# EasyEDA Pro project ProPrj_ESP32智能门锁_2025-03-02.epro, schematic Schematic1

## Sheets
1 ESP32主控: Board Name: Board1; Create Date: 2025-01-09; Page Name: ESP32主控; Project Name: ESP32智能门锁; Schematic Name: Schematic1; Update Date: 2025-03-01; Company: 嘉立创EDA; Page Size: A4; Version: V1.3
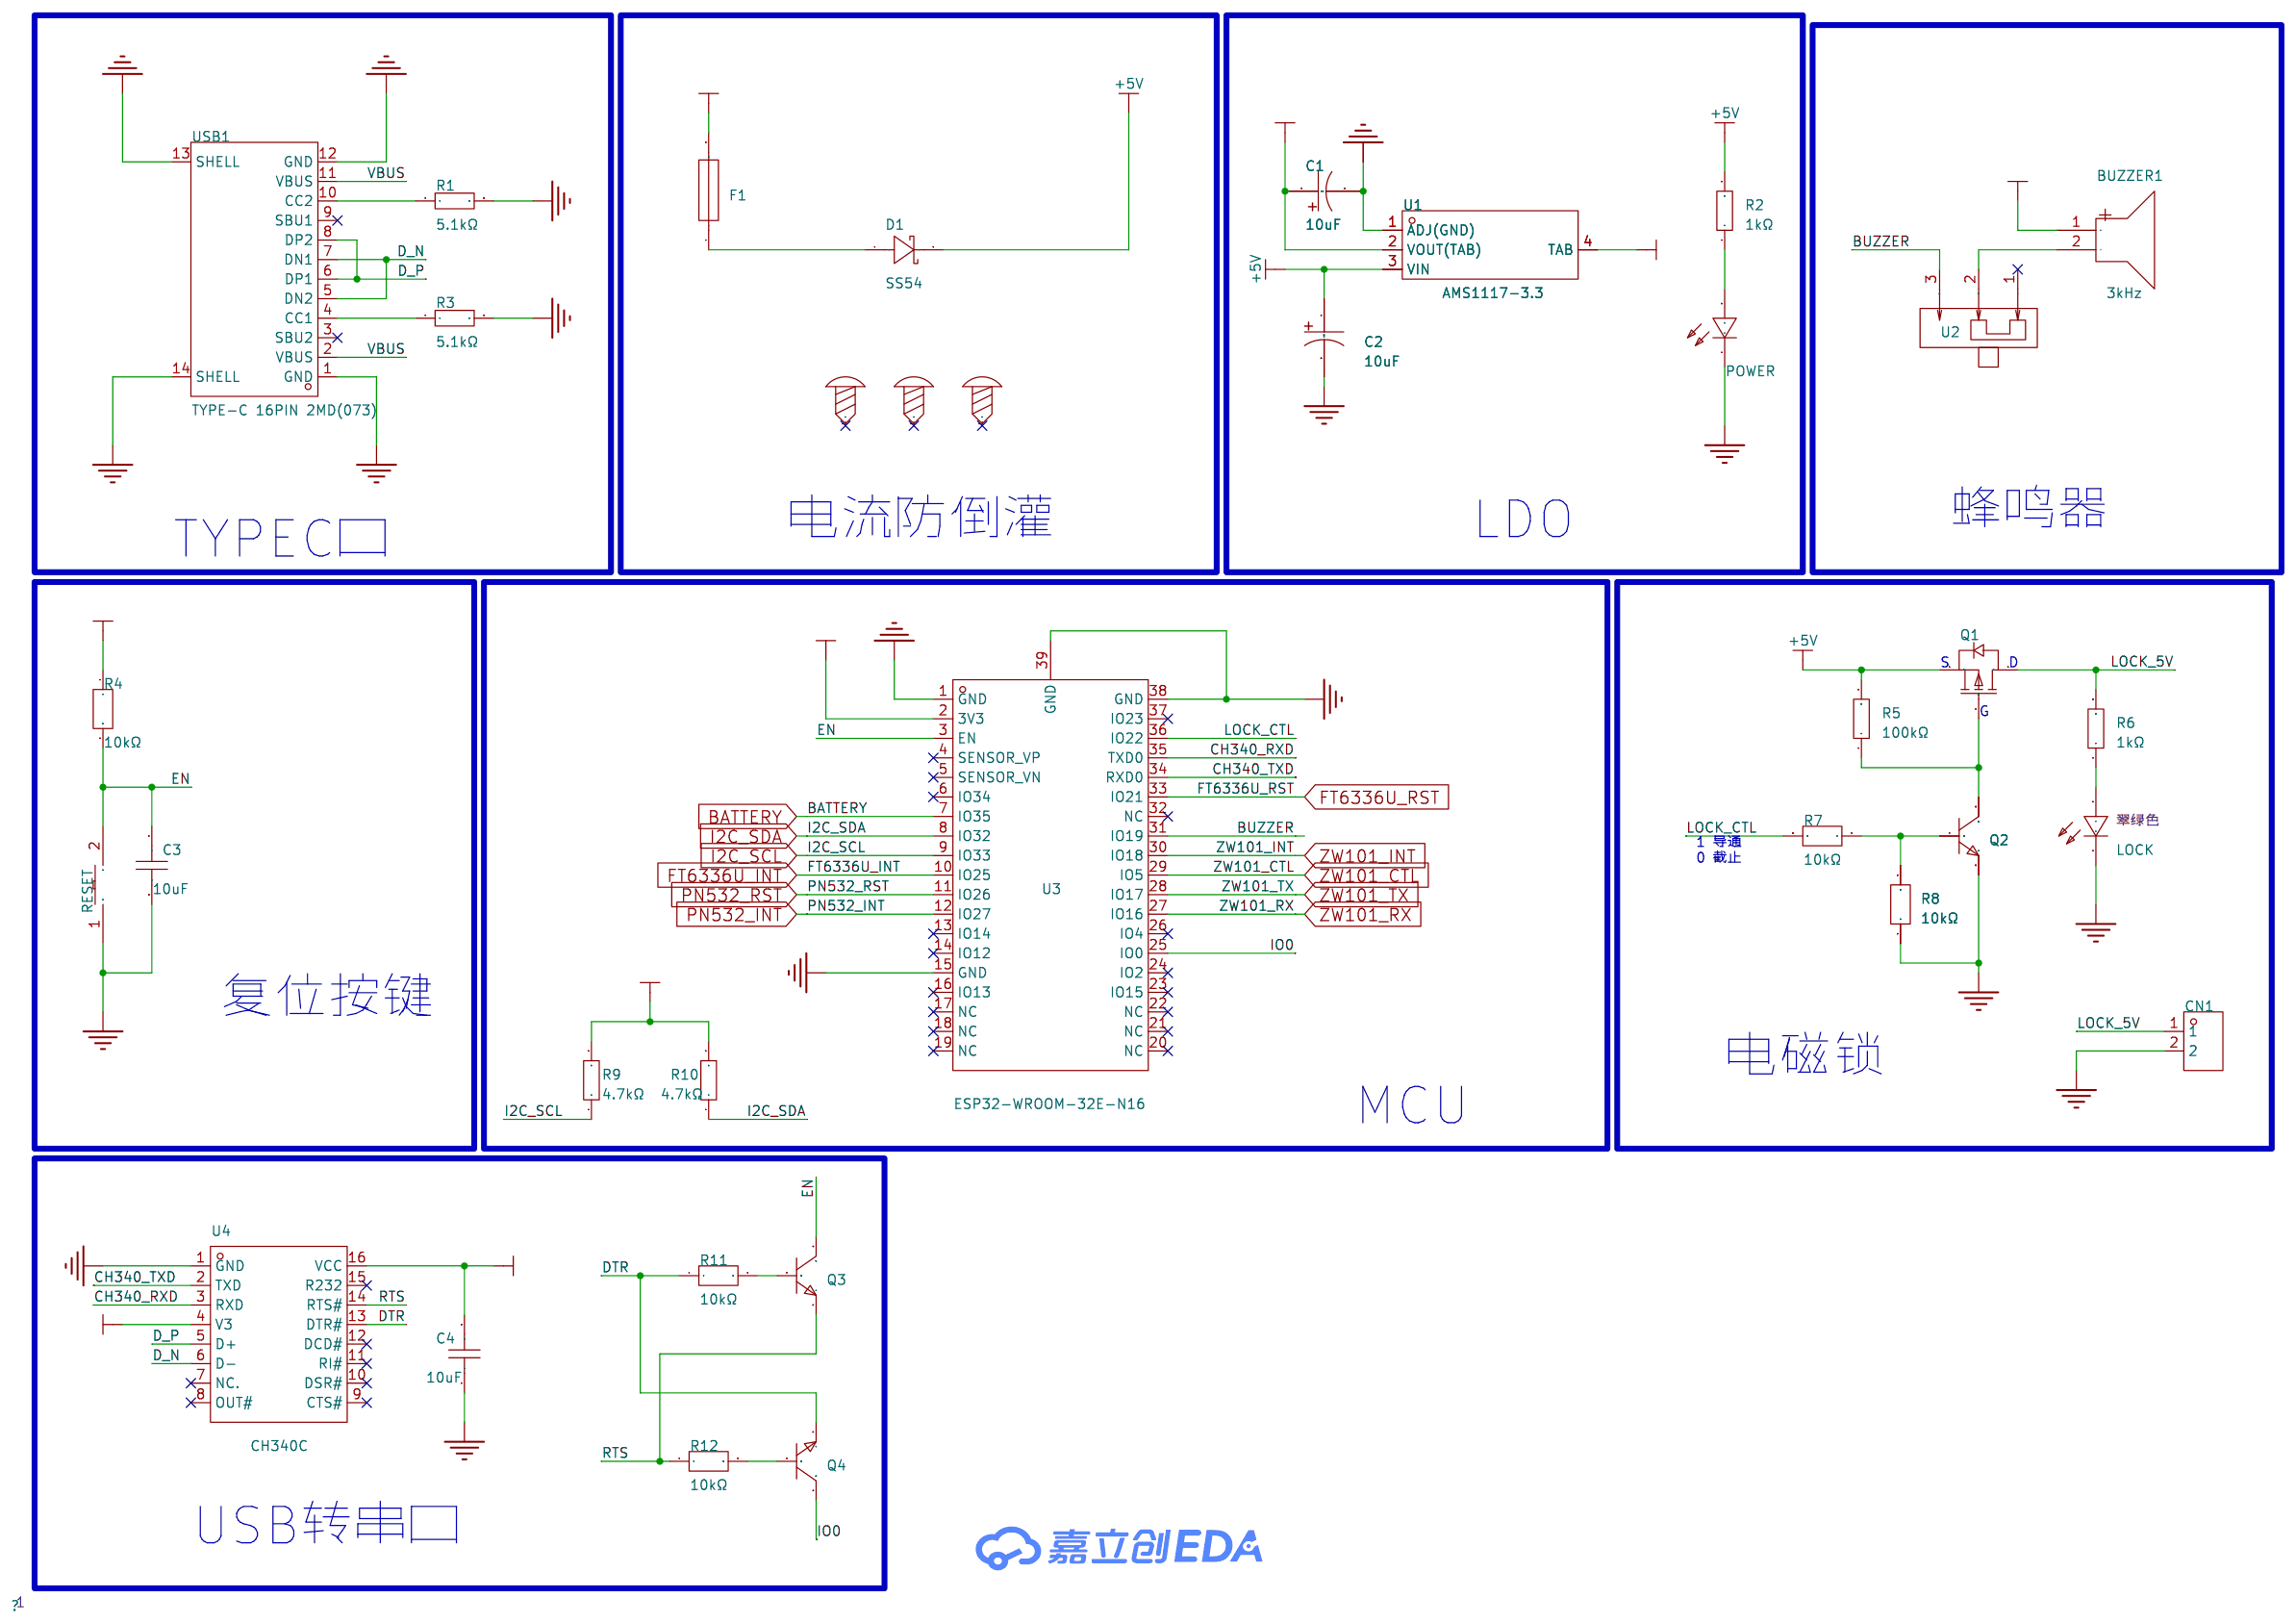
[diagram p0: ESP32主控]
2 PN532: Page Name: PN532; Update Date: 2025-02-12
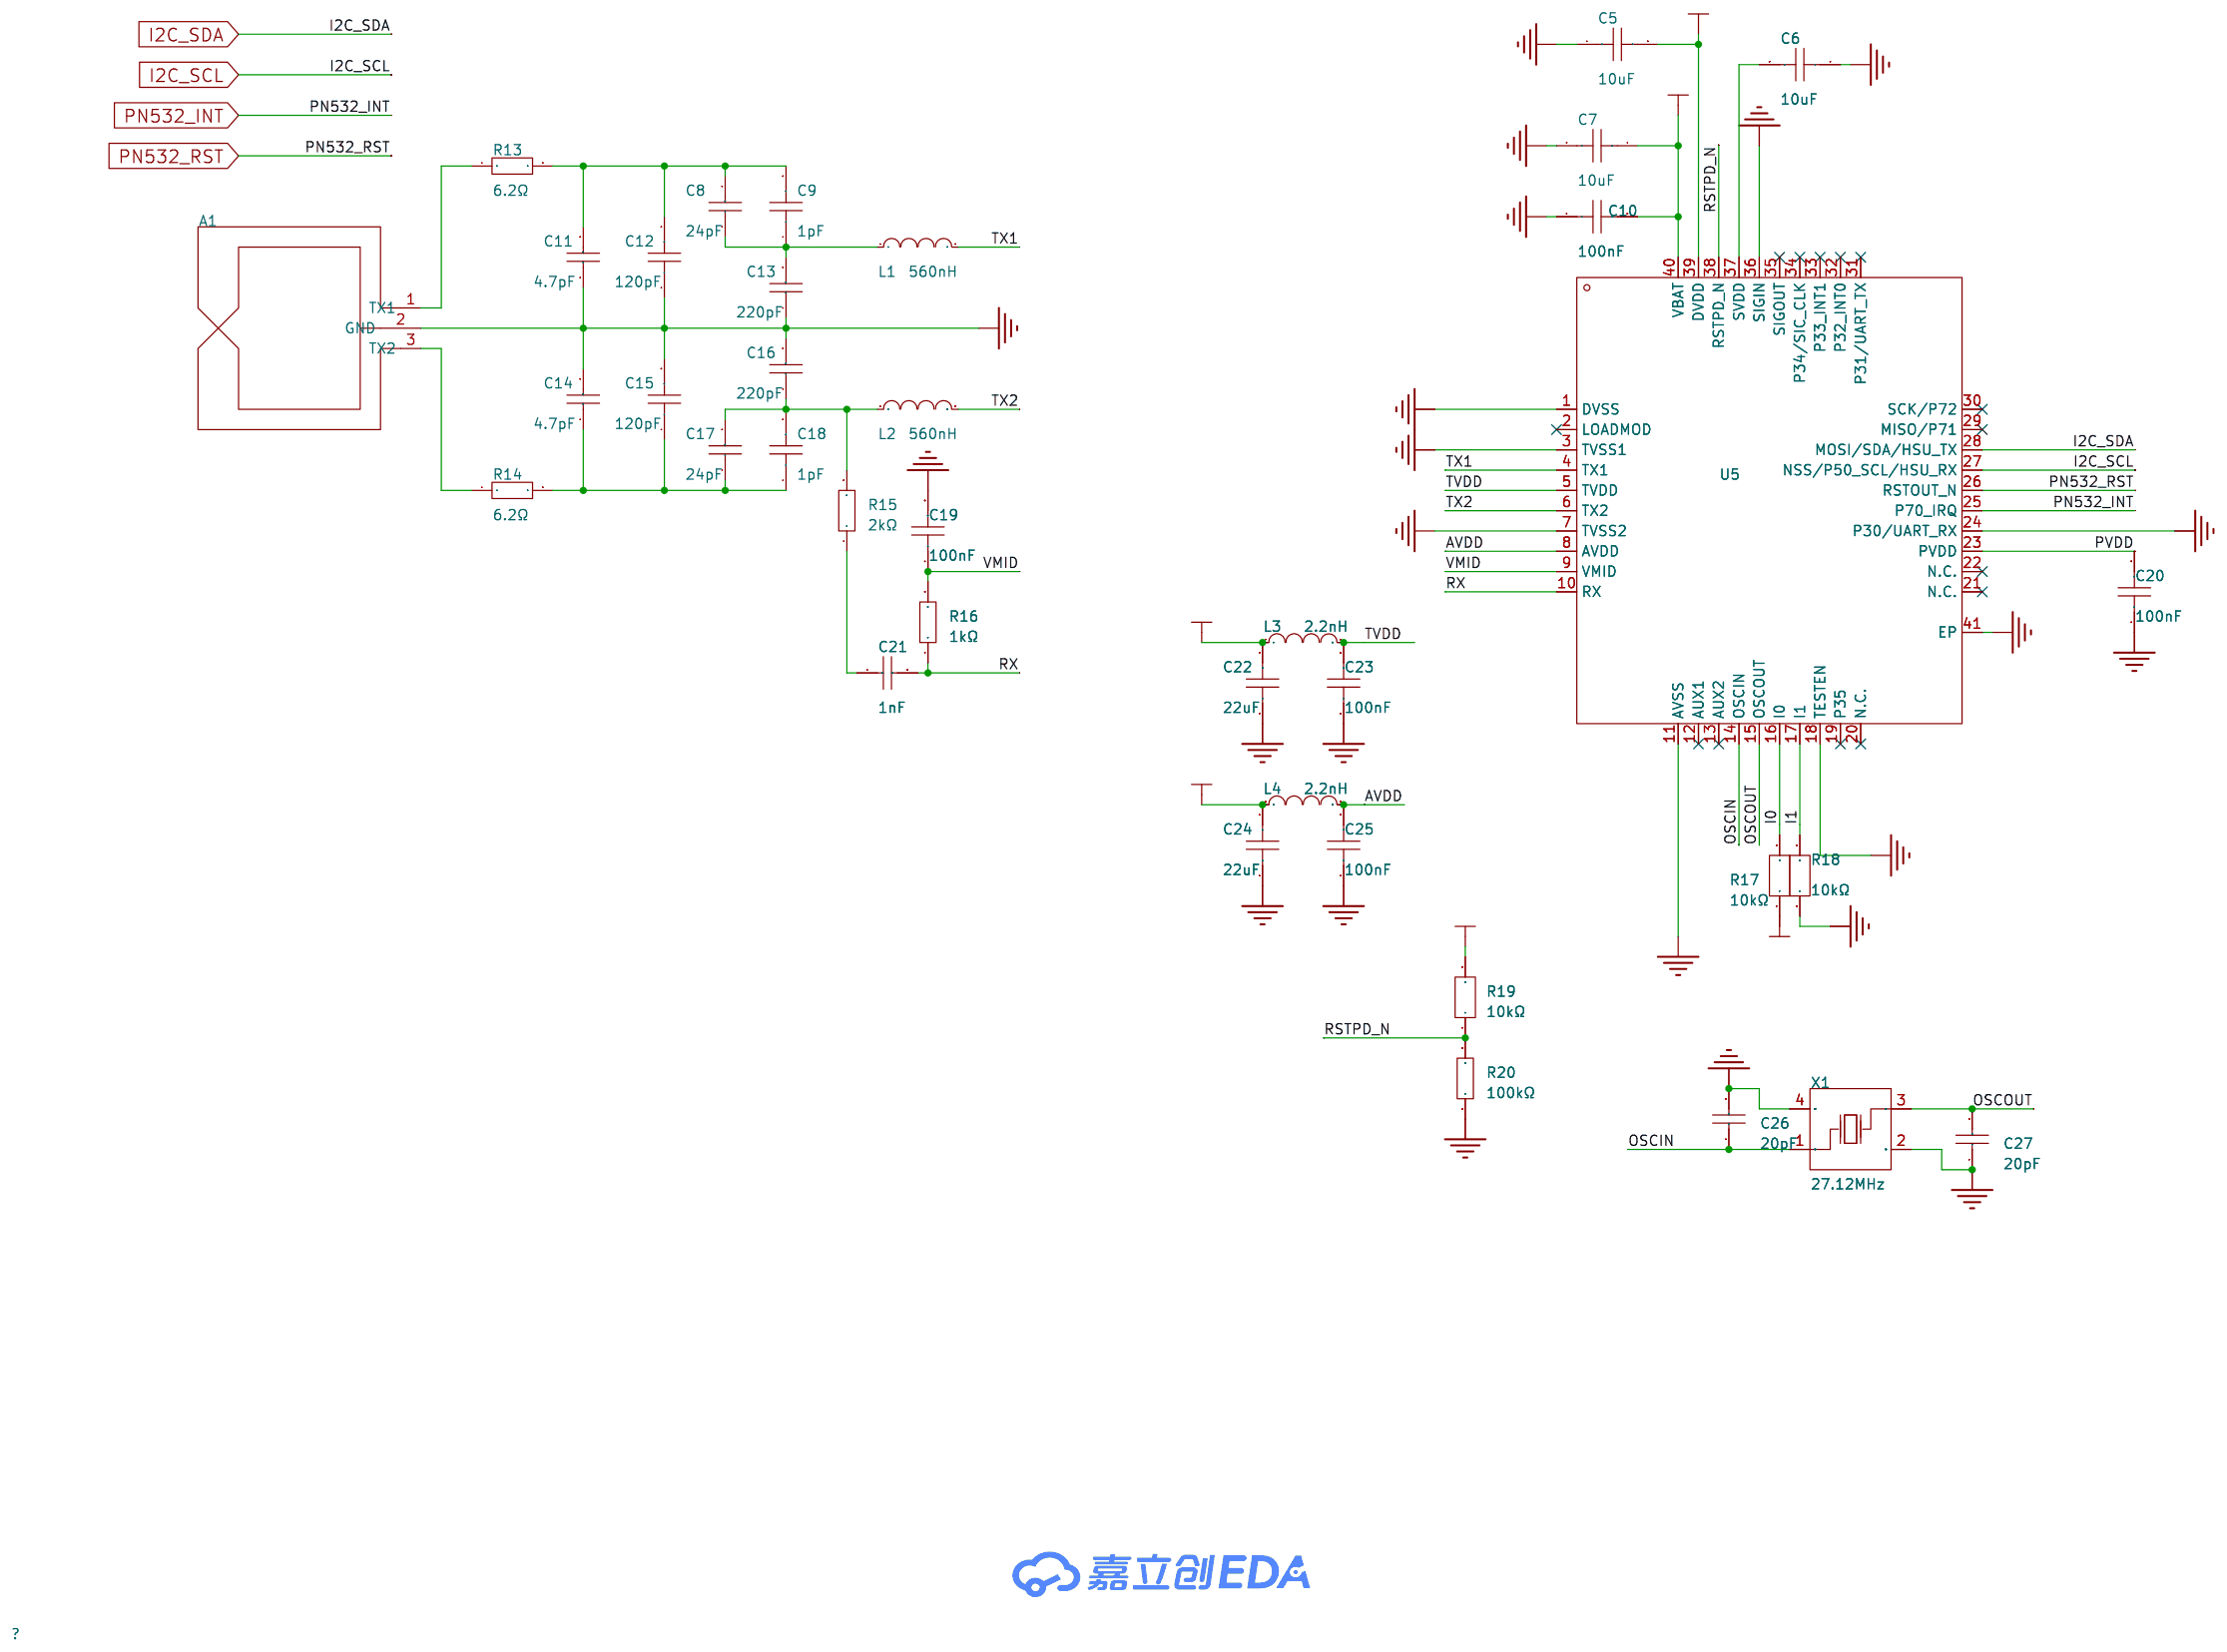
[diagram p1: PN532]
3 other: Page Name: other
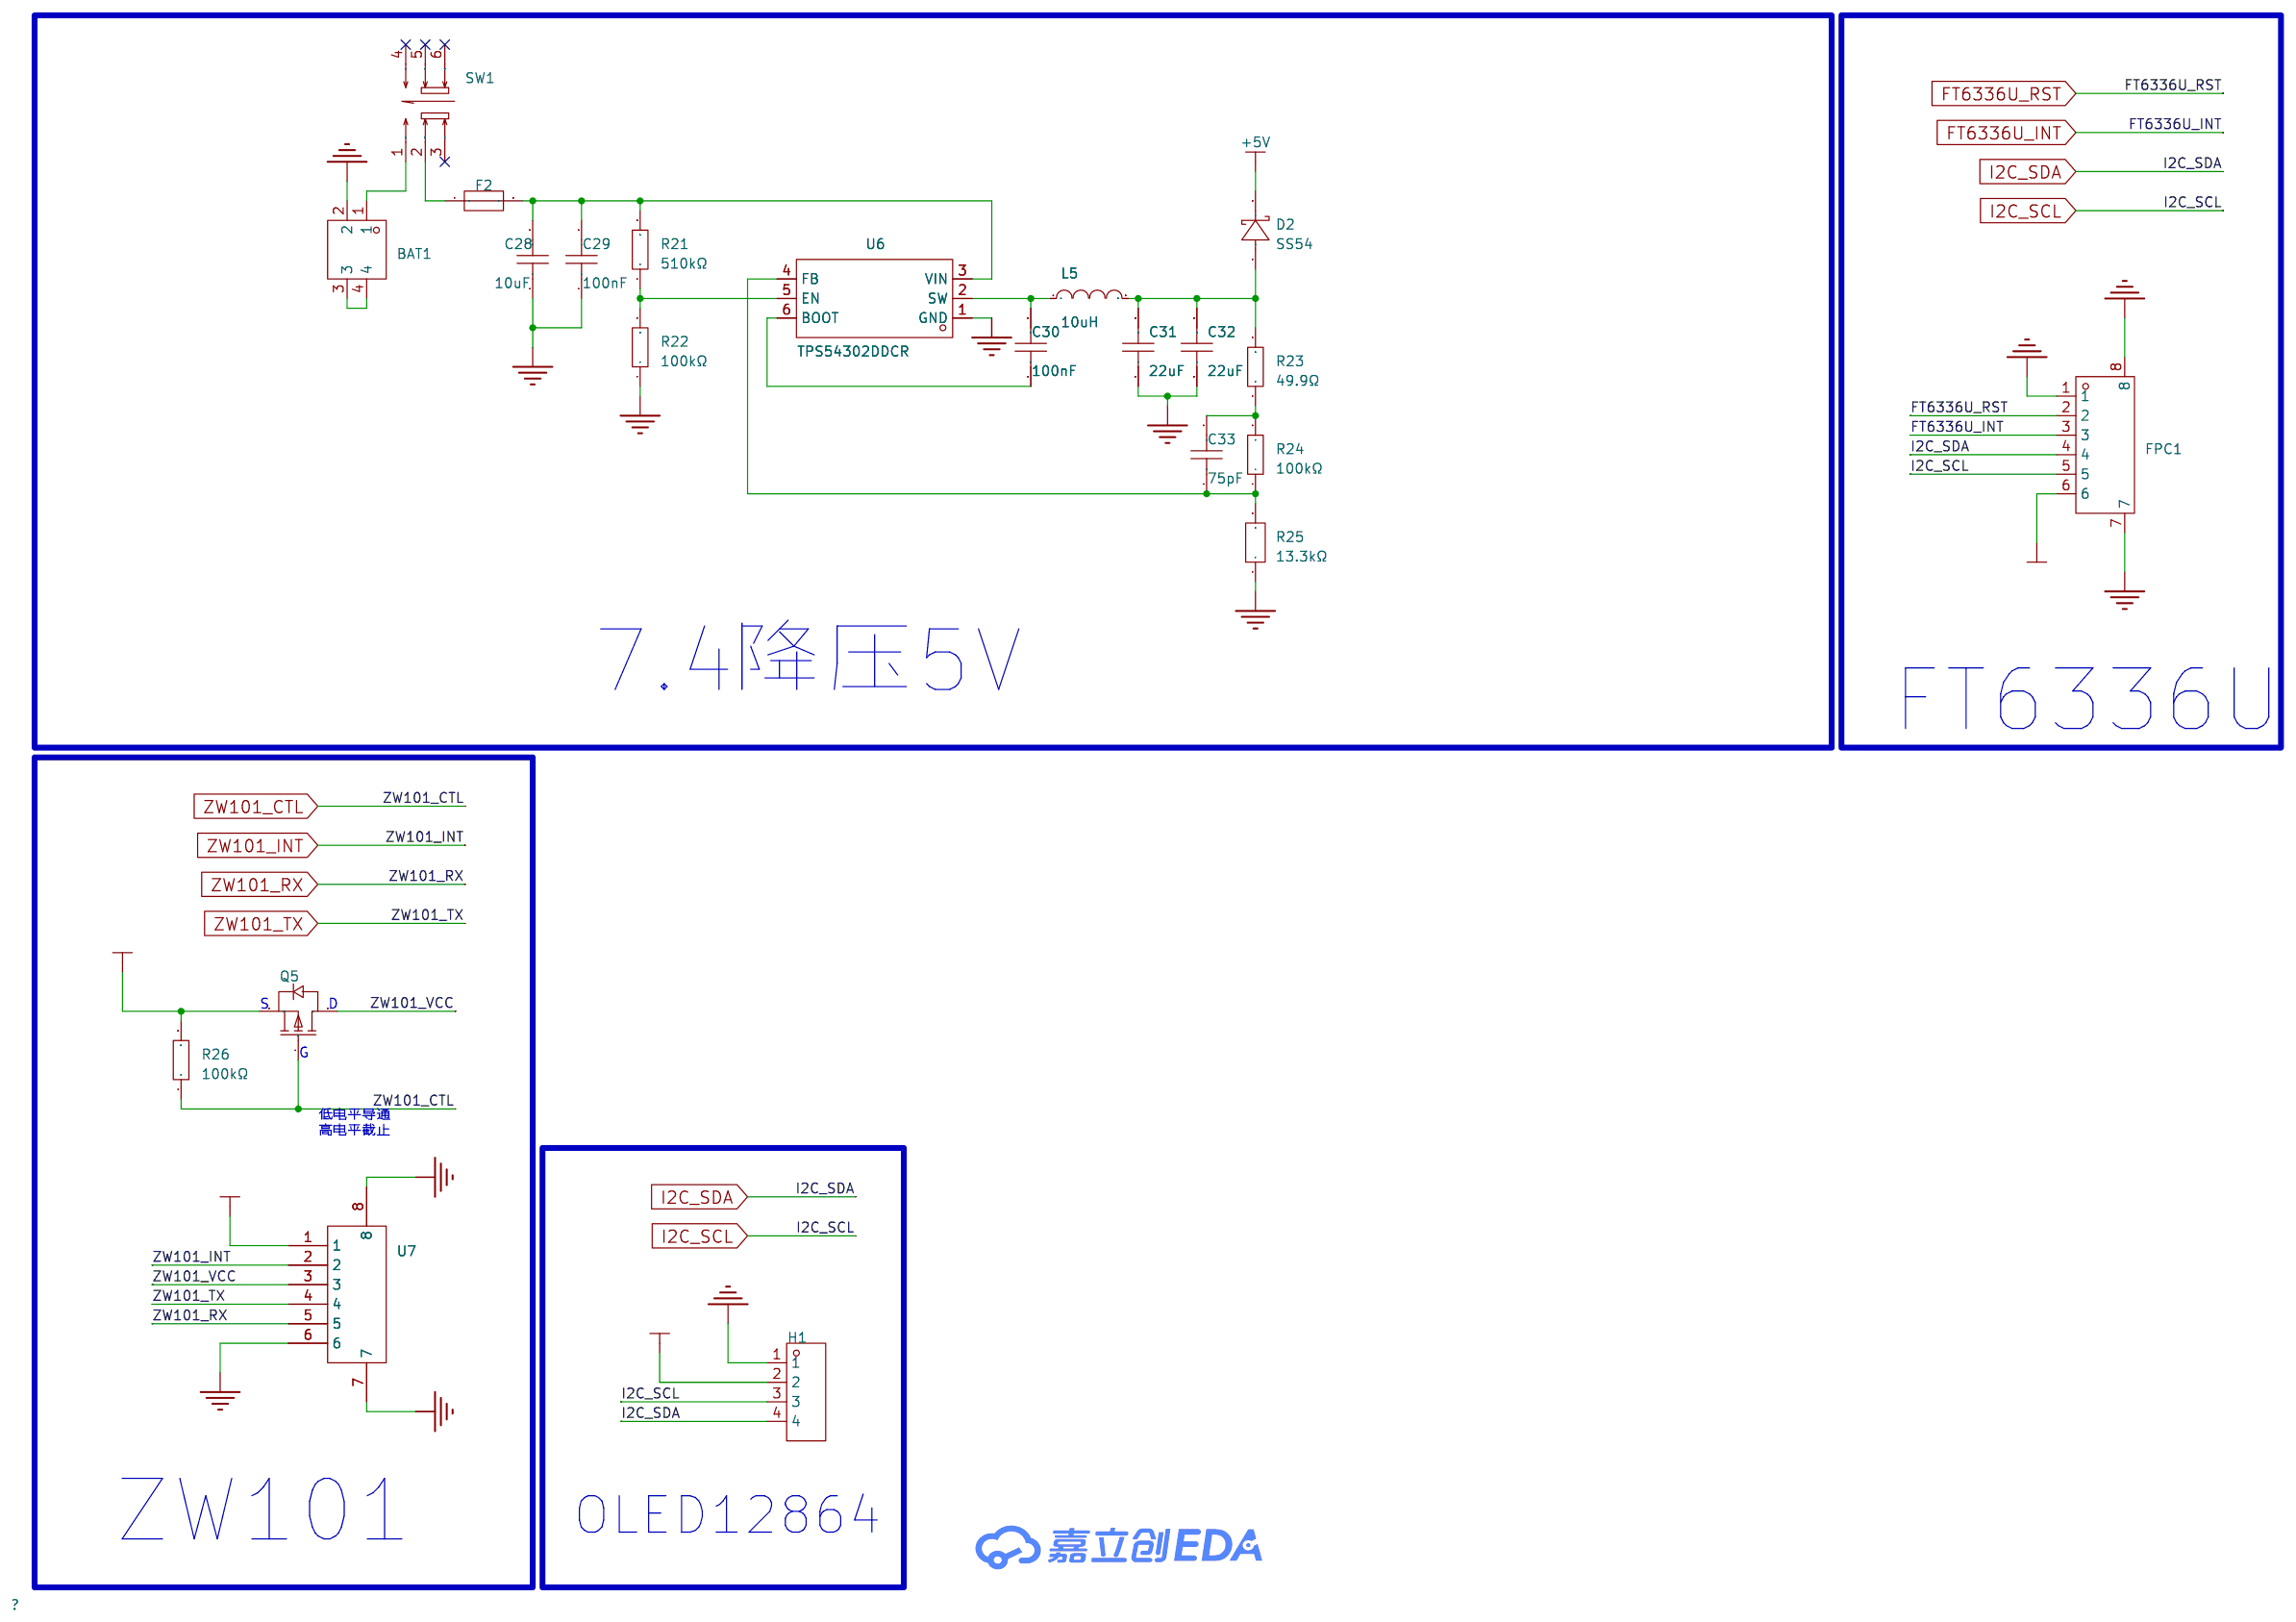
[diagram p2: other]

## Parts
sheet ESP32主控
BUZZER1  3kHz  [BUZ-TH_BD9.0-P5.00-D0.6-FD]
C1  10uF  [CAP-SMD_L3.2-W1.6]
C2  10uF  [CAP-SMD_L3.2-W1.6]
C3  10uF  [C0603]
C4  10uF  [C0603]
CN1  ZX-XH2.54-2PWZ  [CONN-TH_2P-P2.50_ZX-XH2.54-2PWZ]
D1  SS54  [SMA_L4.3-W2.6-LS5.0-FD]
F1  JK-nSMD050-30  [F1206]
LOCK  NCD0603G1  [LED0603-RD_1]
POWER  NCD0603R1  [LED0603-RD_RED]
Q1  SI2301  [SOT-23-3_L2.9-W1.3-P1.90-LS2.4-BR]
Q2  S8050  [SOT-23-3_L2.9-W1.3-P1.90-LS2.4-BR]
Q3  S8050  [SOT-23-3_L2.9-W1.3-P1.90-LS2.4-BR]
Q4  S8050  [SOT-23-3_L2.9-W1.3-P1.90-LS2.4-BR]
R1  5.1kΩ  [R0603]
R2  1kΩ  [R0603]
R3  5.1kΩ  [R0603]
R4  10kΩ  [R0603]
R5  100kΩ  [R0603]
R6  1kΩ  [R0603]
R7  10kΩ  [R0603]
R8  10kΩ  [R0603]
R9  4.7kΩ  [R0603]
R10  4.7kΩ  [R0603]
R11  10kΩ  [R0603]
R12  10kΩ  [R0603]
RESET  TS-1101-C-W  [SW-SMD_L6.0-W3.3-LS8.0]
SCREW1  -  [M2螺丝]  (no BOM)
SCREW2  -  [M2螺丝]  (no BOM)
SCREW3  -  [M2螺丝]  (no BOM)
U1  AMS1117-3.3  [SOT-223-4_L6.5-W3.5-P2.30-LS7.0-BR]
U2  SS-12D00-G3  [SW-TH_3P-L8.8-W3.9-P2.50_SS12D00G3]
U3  ESP32-WROOM-32E-N16  [WIFI-SMD_ESP32-WROOM-32E]
U4  CH340C  [SOP-16_L10.0-W3.9-P1.27-LS6.0-BL]
USB1  TYPE-C 16PIN 2MD(073)  [USB-C-SMD_TYPE-C-6PIN-2MD-073]
sheet other
BAT1  BH-18650-A1BJ021  [BAT-TH_L77.0-W39.9_BH-18650-A1BJ021]
C28  10uF  [C0603]
C29  100nF  [C0603]
C30  100nF  [C0603]
C31  22uF  [C0603]
C32  22uF  [C0603]
C33  75pF  [C0603]
D2  SS54  [SMA_L4.3-W2.6-LS5.0-FD]
F2  BSMD1210-150-16V  [F1210]
FPC1  FPC-05F-6PH20  [FPC-SMD_6P-P0.50_XUNPU_FPC-05F-6PH20]
H1  2.54-1*4P母  [HDR-TH_4P-P2.54-V-F]
L5  10uH  [IND-SMD_L7.3-W6.8]
Q5  SI2301  [SOT-23-3_L2.9-W1.3-P1.90-LS2.4-BR]
R21  510kΩ  [R0603]
R22  100kΩ  [R0603]
R23  49.9Ω  [R0603]
R24  100kΩ  [R0603]
R25  13.3kΩ  [R0603]
R26  100kΩ  [R0603]
SW1  XKB7070-Z  [SW-TH_6P-L7.0-W7.0-P2.00]
U6  TPS54302DDCR  [SOT-23-6_L2.9-W1.6-P0.95-LS2.8-BL]
U7  BM06B-SRSS-TB(LF)(SN)  [CONN-SMD-6P-P1.00_BM06B-SRSS-TB-LF-SN]
sheet PN532
A1  -  [NFC-ANT_L_50_W_40]
C5  10uF  [C0603]
C6  10uF  [C0603]
C7  10uF  [C0603]
C8  24pF  [C0603]
C9  1pF  [C0603]
C10  100nF  [C0603]
C11  4.7pF  [C0603]
C12  120pF  [C0603]
C13  220pF  [C0603]
C14  4.7pF  [C0603]
C15  120pF  [C0603]
C16  220pF  [C0603]
C17  24pF  [C0603]
C18  1pF  [C0603]
C19  100nF  [C0603]
C20  100nF  [C0603]
C21  1nF  [C0603]
C22  22uF  [C0603]
C23  100nF  [C0603]
C24  22uF  [C0603]
C25  100nF  [C0603]
C26  20pF  [C0603]
C27  20pF  [C0603]
L1  560nH  [L0603]
L2  560nH  [L0603]
L3  2.2nH  [L0603]
L4  2.2nH  [L0603]
R13  6.2Ω  [R0603]
R14  6.2Ω  [R0603]
R15  2kΩ  [R0603]
R16  1kΩ  [R0603]
R17  10kΩ  [R0603]
R18  10kΩ  [R0603]
R19  10kΩ  [R0603]
R20  100kΩ  [R0603]
U5  13.56MHz  [QFN-40_L6.0-W6.0-P0.50-BL-EP]
X1  27.12MHz  [CRYSTAL-SMD_4P-L3.2-W2.5-BL]

## Library data of the parts
BUZZER1 = HNB09A03: 驱动方式:有源(内含驱动线路);构造类型:电磁式;频率:3kHz;声压(SPL):85dB;; LCSC Part Name: 电磁式有源一体蜂鸣器HNB09A03; Supplier Part: C96102; Manufacturer: 华能; Supplier Footprint: 插件,D=9mm; JLCPCB Part Class: 扩展库; Datasheet: https://atta.szlcsc.com/upload/public/pdf/source/20241128/61C4C8C3938BB25F7C38FBE94CCE8DCF.pdf; Supplier: LCSC; Driver Circuitry: 有源(内含驱动线路); Technology: 电磁式; Voltage - Supply: 1.5V~4.5V; Current Consumption: 30mA; Sound Pressure Level(SPL): 85dB; Diameter(φD): 9mm; Height: 5.5mm; Operating Temperature: -20℃~+70℃
C1 C2 = CA45-A-16V-10μF-K: 容值:10uF;精度:±10%;额定电压:16V;等效串联电阻:2Ω@100kHz;; LCSC Part Name: 10uF ±10% 16V; Supplier Part: C185774; Manufacturer: TORCH(火炬); Supplier Footprint: CASE-A-3216-16(mm); JLCPCB Part Class: 扩展库; Datasheet: https://atta.szlcsc.com/upload/public/pdf/source/20180731/C185774_22D18ADF2389DA8E0E2B47A85772FA52.pdf; Supplier: LCSC; Tolerance: ±10%; Rated Voltage: 16V; Equivalent Series Resistance(ESR): 2Ω@100kHz; Operating Temperature: -55℃~+125℃
C3-C7 C28 = CL10A106KP8NNNC: 容值:10uF;精度:±10%;额定电压:10V;材质(温度系数):X5R;; LCSC Part Name: 10uF ±10% 10V; Supplier Part: C19702; Manufacturer: SAMSUNG(三星); Supplier Footprint: 0603; JLCPCB Part Class: 基础库; Datasheet: https://atta.szlcsc.com/upload/public/pdf/source/20160218/1457707763339.pdf; Supplier: LCSC; Tolerance: ±10%; Voltage Rated: 10V; Temperature Coefficient: X5R
CN1 = ZX-XH2.54-2PWZ: 插针结构:1x2P;间距:2.5mm;安装方式:弯插;参考系列:XH;总PIN数:2P;排数:1;每排PIN数:2;行距:-;额定电流:3A;触头材质:黄铜;触头镀层:锡;工作温度范围:-25℃~+85℃;; LCSC Part Name: 1x2P 间距:2.5mm 弯插 系列:XH; Supplier Part: C7429641; Manufacturer: Megastar(兆星); Supplier Footprint: 弯插,P=2.5mm; JLCPCB Part Class: 扩展库; Datasheet: https://atta.szlcsc.com/upload/public/pdf/source/20230619/56AE8F2E01CDFEAA97FC89B5ED558AB5.pdf; Supplier: LCSC; Pins Structure: 1x2P; Pitch: 2.5mm; Mounting Type: 弯插; Reference Series: XH; Number of Pins: 2P; Number of Rows: 1; Number of PINs Per Row: 2; Rated Current: 3A; Contact Material: 黄铜; Contact Plating: 锡; Operating Temperature: -25℃~+85℃; Rated Voltage (Max): 250V; Plastic Material: PA66; Flame Retardant Rating: UL94V-0; Color: 白色; Z-Height of the Board: 5.9mm; X-Length of Bottom Edge on Board (Spacing Line): 7.5mm; Y-Width of Bottom Edge on Board: 7.32mm
D1 D2 = SS54_C7420369: 二极管配置:独立式;正向压降(Vf):550mV@5.0A;直流反向耐压(Vr):40V;整流电流:5A;; LCSC Part Name: 电压:40V 电流:5A; Supplier Part: C7420369; Manufacturer: 宏迦橙; Supplier Footprint: SMA(DO-214AC); JLCPCB Part Class: 扩展库; Datasheet: https://atta.szlcsc.com/upload/public/pdf/source/20230828/254C3882F8647358AD9F60DD73611B5E.pdf; Supplier: LCSC; Diode Configuration: 独立式; Forward Voltage (Vf@If): 550mV@5.0A; Reverse Voltage (Vr): 40V; Rectified Current: 5A; Reverse Leakage Current (Ir): 50uA@40V
F1 = JK-nSMD050-30: 最大电压:30V;最大电流:100A;保持电流:500mA;跳闸电流:1A;; LCSC Part Name: 30V 500mA 1206自恢复; Supplier Part: C720075; Manufacturer: JK(金科); Supplier Footprint: 1206; JLCPCB Part Class: 扩展库; Datasheet: https://atta.szlcsc.com/upload/public/pdf/source/20200810/C720075_06AF2D4541537091880CC35F0EFB49F8.pdf; Supplier: LCSC; Operating Voltage (Max): 30V; Current Rating (Max): 100A; Hold Current: 500mA; Trip Current: 1A; Power Dissipation: 600mW; Resistance - Initial (Ri) (Min): 150mΩ; Resistance - Post Trip (R1) (Max): 300mΩ; Maximum Time to Trip: 100ms; Operating Temperature: -40℃~+85℃
LOCK = NCD0603G1: 翠绿色; Supplier Part: C84267; Manufacturer: 国星光电; Supplier Footprint: 0603; Datasheet: https://atta.szlcsc.com/upload/public/pdf/source/20200820/C84267_04BA7703640BAC111D09F5EFB971FBF3.pdf; Supplier: LCSC; Emitted Color: 翠绿色; Forward Voltage (VF): 2.6V~3.6V; Power Dissipation: 72mW; Forward Current: 10mA; Dominant Wavelength: 515nm~530nm; Lens Color: 无色透明透镜; Luminous Intensity: 330mcd~900mcd; Viewing Angle: 130°; Operating Temperature: -30℃~+85℃
POWER = NCD0603R1_C84263: 灯头类型:-;发光颜色:红色;正向电压(VF):1.6V~2.6V;功率:65mW;正向电流:20mA;主波长:615nm~630nm;二极管配置:独立二极管;透镜颜色:无色透明透镜;色温:-;发光强度:80mcd~220mcd;发光角度:130°;载带方式:-;工作温度:-30℃~+85℃;; Supplier Part: C84263; Manufacturer: 国星光电; Supplier Footprint: 0603; JLCPCB Part Class: 扩展库; Datasheet: https://atta.szlcsc.com/upload/public/pdf/source/20200820/C84263_DABC6A75E58F576973B407FDBA283D60.pdf; Supplier: LCSC; Emitted Color: 红色; Forward Voltage (VF): 1.6V~2.6V; Power Dissipation: 65mW; Forward Current: 20mA; Dominant Wavelength: 615nm~630nm; Diode Configuration: 独立二极管; Lens Color: 无色透明透镜; Luminous Intensity: 80mcd~220mcd; Viewing Angle: 130°; Operating Temperature: -30℃~+85℃
Q1 Q5 = SI2301_C2891731: 类型:1个P沟道;漏源电压(Vdss):20V;连续漏极电流(Id):2.2A;导通电阻(RDS(on)@Vgs,Id):120mΩ@4.5V,1.5A;功率(Pd):700mW;阈值电压(Vgs(th)@Id):1.5V@250uA;; LCSC Part Name: P沟道,电流:2.2A,耐压:20V; Supplier Part: C2891731; Manufacturer: YONGYUTAI(永裕泰); Supplier Footprint: SOT-23; JLCPCB Part Class: 扩展库; Datasheet: https://atta.szlcsc.com/upload/public/pdf/source/20210901/BD7F488CADB80954861F21BEE026F08A.pdf; Supplier: LCSC; Type: 1个P沟道; Drain Source Voltage (Vdss): 20V; Continuous Drain Current (Id): 2.2A; Drain Source On Resistance (RDS(on)@Vgs,Id): 120mΩ@4.5V,1.5A; Power Dissipation (Pd): 700mW; Gate Threshold Voltage (Vgs(th)@Id): 1.5V@250uA; Input Capacitance (Ciss@Vds): 200pF@10V; Operating Temperature: -55℃~+150℃
Q2-Q4 = S8050_C2891804: 晶体管类型:NPN;集电极电流(Ic):500mA;集射极击穿电压(Vceo):25V;功率(Pd):300mW;直流电流增益(hFE@Ic,Vce):400@50mA,1V;; LCSC Part Name: NPN 电流:500mA 耐压:25V; Supplier Part: C2891804; Manufacturer: YONGYUTAI(永裕泰); Supplier Footprint: SOT-23; JLCPCB Part Class: 扩展库; Datasheet: https://atta.szlcsc.com/upload/public/pdf/source/20210901/5347316A10609C628D4D69AE01446E5B.pdf; Supplier: LCSC; Transistor Type: NPN; Collector Current (Ic): 500mA; Collector-Emitter Breakdown Voltage (Vceo): 25V; Power Dissipation (Pd): 300mW; DC Current Gain (hFE@Ic,Vce): 400@50mA,1V; Collector Cut-Off Current (Icbo): 1uA; Collector-Emitter Saturation Voltage (VCE(sat)@Ic,Ib): 500mV@500mA,50mA
R1 R3 = 0603WAF5101T5E: 电阻类型:厚膜电阻;阻值:5.1kΩ;精度:±1%;功率:100mW;最大工作电压:75V;温度系数:±100ppm/℃;; LCSC Part Name: 5.1kΩ ±1% 100mW 厚膜电阻; Supplier Part: C23186; Manufacturer: UNI-ROYAL(厚声); Supplier Footprint: 0603; JLCPCB Part Class: Basic Part; Datasheet: https://atta.szlcsc.com/upload/public/pdf/source/20200306/C422600_1E6D84923E4A46A82E41ADD87F860B5C.pdf; Supplier: LCSC; Type: 厚膜电阻; Tolerance: ±1%; Power(Watts): 100mW; Overload Voltage (Max): 75V; Temperature Coefficient: ±100ppm/℃; Operating Temperature Range: -55℃~+155℃
R2 R6 R16 = 0603WAF1001T5E: 电阻类型:厚膜电阻;阻值:1kΩ;精度:±1%;功率:100mW;最大工作电压:75V;温度系数:±100ppm/℃;; LCSC Part Name: 1kΩ ±1% 100mW 厚膜电阻; Supplier Part: C21190; Manufacturer: UNI-ROYAL(厚声); Supplier Footprint: 0603; JLCPCB Part Class: 基础库; Datasheet: https://atta.szlcsc.com/upload/public/pdf/source/20200306/C422600_1E6D84923E4A46A82E41ADD87F860B5C.pdf; Supplier: LCSC; Type: 厚膜电阻; Tolerance: ±1%; Power(Watts): 100mW; Overload Voltage (Max): 75V; Temperature Coefficient: ±100ppm/℃; Operating Temperature Range: -55℃~+155℃
R4 R7 R8 R11 R12 R17-R19 = FRC0603J103TS: 电阻类型:厚膜电阻;阻值:10kΩ;精度:±5%;功率:100mW;最大工作电压:75V;温度系数:±100ppm/℃;; LCSC Part Name: 10kΩ ±5% 100mW 厚膜电阻; Supplier Part: C2930027; Manufacturer: FOJAN(富捷); Supplier Footprint: 0603; JLCPCB Part Class: 扩展库; Datasheet: https://atta.szlcsc.com/upload/public/pdf/source/20211221/925EC7D7225764EE0046F22065062C87.pdf; Supplier: LCSC; Type: 厚膜电阻; Tolerance: ±5%; Power(Watts): 100mW; Overload Voltage (Max): 75V; Temperature Coefficient: ±100ppm/℃; Operating Temperature Range: -55℃~+155℃
R5 R20 R22 R24 R26 = 0603WAJ0104T5E: 电阻类型:厚膜电阻;阻值:100kΩ;精度:±5%;功率:100mW;最大工作电压:75V;温度系数:±100ppm/℃;; LCSC Part Name: 100kΩ ±5% 100mW 厚膜电阻; Supplier Part: C15458; Manufacturer: UNI-ROYAL(厚声); Supplier Footprint: 0603; JLCPCB Part Class: 扩展库; Datasheet: https://atta.szlcsc.com/upload/public/pdf/source/20200306/C422600_1E6D84923E4A46A82E41ADD87F860B5C.pdf; Supplier: LCSC; Type: 厚膜电阻; Tolerance: ±5%; Power(Watts): 100mW; Overload Voltage (Max): 75V; Temperature Coefficient: ±100ppm/℃; Operating Temperature Range: -55℃~+155℃
R9 R10 = 0603WAF4701T5E: 电阻类型:厚膜电阻;阻值:4.7kΩ;精度:±1%;功率:100mW;最大工作电压:75V;温度系数:±100ppm/℃;; LCSC Part Name: 4.7kΩ ±1% 100mW 厚膜电阻; Supplier Part: C23162; Manufacturer: UNI-ROYAL(厚声); Supplier Footprint: 0603; JLCPCB Part Class: 基础库; Datasheet: https://atta.szlcsc.com/upload/public/pdf/source/20200306/C422600_1E6D84923E4A46A82E41ADD87F860B5C.pdf; Supplier: LCSC; Type: 厚膜电阻; Tolerance: ±1%; Power(Watts): 100mW; Overload Voltage (Max): 75V; Temperature Coefficient: ±100ppm/℃; Operating Temperature Range: -55℃~+155℃
RESET = TS-1101-C-W: 电路结构:单刀单掷;按钮形状:矩形按钮;作用力:260gf;安装方式:立贴;开关长度:6mm;开关宽度:3.6mm;开关高度:2.5mm;带支架:不带;触点电流:50mA;额定电压(AC):-;额定电压(DC):12V;额定功率:-;绝缘电阻:-;带灯:无;机械寿命:5万次;; LCSC Part Name: 6*3.6*2.5mm 立贴 轻触开关; Supplier Part: C318938; Manufacturer: XKB Connectivity(中国星坤); Supplier Footprint: SMD; Datasheet: https://atta.szlcsc.com/upload/public/pdf/source/20200227/C318938_C2E53B1EEDE37D980A33616AC086DE53.pdf; Supplier: LCSC; Circuit: 单刀单掷; Actuator Style: 矩形按钮; Operating Force: 260gf; Mounting Style: 立贴; Switch Length: 6mm; Switch Width: 3.6mm; Switch Height: 2.5mm; Strike Gundam: 不带; Contact Current: 50mA; Voltage Rating (DC): 12V; Actuator/Cap Color: 白色带淡绿; With Lamp: 无; Mechanical Life: 5万次; Operating Temperature: -30℃~+85℃
SCREW1-SCREW3 = M2螺丝: Supplier Footprint: 插件; Check: false
U1 = AMS1117-3.3_C347222: 输出类型:固定;工作电压:12V;输出电压:3.3V;输出电流:1A;电源纹波抑制比(PSRR):60dB@(120Hz);输出极性:正极;; LCSC Part Name: 输出:3.3V 电流:1A 耐压:12V; Supplier Part: C347222; Manufacturer: UMW(友台半导体); Supplier Footprint: SOT-223; JLCPCB Part Class: 扩展库; Datasheet: https://atta.szlcsc.com/upload/public/pdf/source/20241218/BAF0263FA2E44BCD8AF41AA4FA04EFAA.pdf; Supplier: LCSC; Output Type: 固定; Maximum Input Voltage: 12V; Output Voltage: 3.3V; Output Current: 1A; Power Supply Rejection Ratio (PSRR): 60dB@(120Hz); Dropout Voltage: 1.3V@(1A); Feature: 过流保护(OCP); Output Polarity: 正极; Number of Outputs: 1
U2 = SS-12D00-G3: 操作正拨 插件立式 尺寸大型 两档位; Supplier Part: C22355741; Manufacturer: SOFNG(硕方); Supplier Footprint: 插件-3P,8.8x3.9mm; JLCPCB Part Class: 扩展库; Datasheet: https://atta.szlcsc.com/upload/public/pdf/source/20240529/1037A069FE9BBCECE56007AB916D4384.pdf; Supplier: LCSC
U3 = ESP32-WROOM-32E-N16_C701343: ESP32-WROOM-32E 集成 ESP32-D0WD-V3 芯片，具有高稳定性和安全性能。; LCSC Part Name: 通用型Wi-Fi+BT+BLE MCU模组; Supplier Part: C701343; Manufacturer: ESPRESSIF(乐鑫); Supplier Footprint: SMD,18x25.5mm; Datasheet: https://atta.szlcsc.com/upload/public/pdf/source/20241030/447B1C85FFE3FB0A37F75624F2C6635F.pdf; Supplier: LCSC
U4 = CH340C: 应用功能:收发器;接口协议:USB 2.0;数据速率:2Mbps;; LCSC Part Name: CH340C USB转串口芯片 CH340; Supplier Part: C84681; Manufacturer: WCH(南京沁恒); Supplier Footprint: SOP-16; JLCPCB Part Class: 扩展库; Datasheet: https://atta.szlcsc.com/upload/public/pdf/source/20240619/63986D8440D4E5267A77ACD891CC4DE3.pdf; Supplier: LCSC; Applications Function: 收发器; Protocol: USB 2.0; Supply Voltage: 3.3V；5V; Data Rate: 2Mbps
USB1 = TYPE-C 16PIN 2MD(073): 连接器类型:Type-C;标准:USB 3.1;公母:母;安装方式:卧贴;触点数量:16P;端口数量:1;额定电流 - 电源:5A;工作温度范围:-25℃~+85℃;; LCSC Part Name: Type-C 母 卧贴; Supplier Part: C2765186; Manufacturer: SHOU HAN(首韩); Supplier Footprint: SMD; Datasheet: https://atta.szlcsc.com/upload/public/pdf/source/20211123/39B17C16241EAC15C5E277BDA434118E.pdf; Supplier: LCSC; Connector Type: Type-C; Standard: USB 3.1; Gender: 母; Mounting Style: 卧贴; Number of Contacts: 16P; Number of Ports: 1; Current Rating - Power (Max): 5A; Operating Temperature Range: -25℃~+85℃; Rated Voltage (Max): 5V; Connect-Disconnect Life: 5千次; Core Colour: 黑色
BAT1 = BH-18650-A1BJ021: 连接器类型:电池盒;适用电池规格:-;触点电镀:镍;工作温度范围:-25℃~+85℃;; LCSC Part Name: 电池盒; Supplier Part: C20606804; Manufacturer: MYOUNG(美阳); Supplier Footprint: 插件; JLCPCB Part Class: 扩展库; Datasheet: https://atta.szlcsc.com/upload/public/pdf/source/20240112/147D77B47FAFC966051AFF7CD950677D.pdf; Supplier: LCSC; Connector Type: 电池盒; Contact Plating: 镍; Operating Temperature Range: -25℃~+85℃
C10 C19 C20 C23 C25 C29 C30 = CGA0603X7R104K500JT: 容值:100nF;精度:±10%;额定电压:50V;材质(温度系数):X7R;; LCSC Part Name: 100nF ±10% 50V; Supplier Part: C6119867; Manufacturer: HRE(芯声); Supplier Footprint: 0603; Supplier: LCSC; Tolerance: ±10%; Voltage Rated: 50V; Temperature Coefficient: X7R
C22 C24 C31 C32 = CL10A226MQ8NRNC: 容值:22uF;精度:±20%;额定电压:6.3V;材质(温度系数):X5R;; LCSC Part Name: 22uF ±20% 6.3V; Supplier Part: C59461; Manufacturer: SAMSUNG(三星); Supplier Footprint: 0603; JLCPCB Part Class: 基础库; Datasheet: https://atta.szlcsc.com/upload/public/pdf/source/20160218/1457707763339.pdf; Supplier: LCSC; Tolerance: ±20%; Voltage Rated: 6.3V; Temperature Coefficient: X5R
C33 = CC0603JRNPO9BN750: 容值:75pF;精度:±5%;额定电压:50V;材质(温度系数):NP0;; LCSC Part Name: 75pF ±5% 50V; Supplier Part: C282074; Manufacturer: YAGEO(国巨); Supplier Footprint: 0603; JLCPCB Part Class: 扩展库; Datasheet: https://atta.szlcsc.com/upload/public/pdf/source/20181008/C309499_21CC21451B82C39E3D92150FD6B30293.pdf; Supplier: LCSC; Tolerance: ±5%; Voltage Rated: 50V; Temperature Coefficient: NP0
F2 = BSMD1210-150-16V: 最大电压:16V;最大电流:100A;保持电流:1.5A;跳闸电流:3A;; LCSC Part Name: 16V 1.5A 1210自恢复; Supplier Part: C7589021; Manufacturer: BHFUSE(佰宏); Supplier Footprint: 1210; JLCPCB Part Class: 扩展库; Datasheet: https://atta.szlcsc.com/upload/public/pdf/source/20230901/3BD0067D95828A491069C1326596E15D.pdf; Supplier: LCSC; Operating Voltage (Max): 16V; Current Rating (Max): 100A; Hold Current: 1.5A; Trip Current: 3A; Power Dissipation: 800mW; Resistance - Initial (Ri) (Min): 30mΩ; Resistance - Post Trip (R1) (Max): 110mΩ; Maximum Time to Trip: 500ms; Operating Temperature: -40℃~+85℃
FPC1 = FPC-05F-6PH20: 锁定特性:翻盖式;触点类型:下接;触点数量:6P;间距:0.5mm;安装类型:卧贴;工作温度范围:-25℃~+85℃;; LCSC Part Name: 间距:0.5mm P数:6P 翻盖式 下接; Supplier Part: C2856796; Manufacturer: XUNPU(讯普); Supplier Footprint: SMD,P=0.5mm,卧贴; JLCPCB Part Class: 扩展库; Datasheet: https://atta.szlcsc.com/upload/public/pdf/source/20210922/16B003FB53336DDF6538142CC465AC4D.pdf; Supplier: LCSC; Locking Feature: 翻盖式; Contact Type: 下接; Number of Contacts: 6P; Pitch: 0.5mm; Mounting Type: 卧贴; FFC, FCB Thickness: 0.3mm; Height Above Board: 2mm; Operating Temperature Range: -25℃~+85℃
H1 = 2.54-1*4P母: 插孔结构:1x4P;间距:2.54mm;行距:-;圆孔/方孔:方孔;安装类型:直插;排数:单排;总孔位数:4P;额定电流:3A;额定电压:-;插孔方向:顶部;塑高:-;触头材质:青铜;触头镀层:-;工作温度范围:-40℃~+105℃;焊接温度(最大值):-;; LCSC Part Name: 间距:2.54mm 1x4P 直插; Supplier Part: C2718488; Manufacturer: BOOMELE(博穆精密); Supplier Footprint: 插件,P=2.54mm; JLCPCB Part Class: 扩展库; Datasheet: https://atta.szlcsc.com/upload/public/pdf/source/20210301/C2718488_F4427B881E42CAA8DDB0B1C12B3A522C.pdf; Supplier: LCSC; Holes Structure: 1x4P; Pitch: 2.54mm; Circular Hole / Square Hole: 方孔; Mounting Type: 直插; Number of Rows: 单排; Number of Holes: 4P; Current Rating (Max): 3A; Holes Direction: 顶部; Contact Material: 青铜; Operating Temperature Range: -40℃~+105℃
L5 = FXL0630-100-M: 电感值:10uH;精度:±20%;额定电流:4.5A;饱和电流(Isat):5.5A;类型:一体成型电感;; LCSC Part Name: 10uH ±20% 5.5A; Supplier Part: C167223; Manufacturer: cjiang(长江微电); Supplier Footprint: SMD,6.6x7mm; JLCPCB Part Class: 扩展库; Datasheet: https://atta.szlcsc.com/upload/public/pdf/source/20240426/3189EA8206330E2108542F9E34E540E7.pdf; Supplier: LCSC; Tolerance: ±20%; Rated Current: 4.5A; Saturation Current (Isat): 5.5A; DC Resistance (DCR): 68mΩ; Type: 一体成型电感
R21 = 0603WAF5103T5E: 电阻类型:厚膜电阻;阻值:510kΩ;精度:±1%;功率:100mW;最大工作电压:75V;温度系数:±100ppm/℃;; LCSC Part Name: 510kΩ ±1% 100mW 厚膜电阻; Supplier Part: C23192; Manufacturer: UNI-ROYAL(厚声); Supplier Footprint: 0603; JLCPCB Part Class: 基础库; Datasheet: https://atta.szlcsc.com/upload/public/pdf/source/20200306/C422600_1E6D84923E4A46A82E41ADD87F860B5C.pdf; Supplier: LCSC; Type: 厚膜电阻; Tolerance: ±1%; Power(Watts): 100mW; Overload Voltage (Max): 75V; Temperature Coefficient: ±100ppm/℃; Operating Temperature Range: -55℃~+155℃
R23 = 0603WAF499JT5E: 电阻类型:厚膜电阻;阻值:49.9Ω;精度:±1%;功率:100mW;最大工作电压:75V;温度系数:±100ppm/℃;; LCSC Part Name: 49.9Ω ±1% 100mW 厚膜电阻; Supplier Part: C23185; Manufacturer: UNI-ROYAL(厚声); Supplier Footprint: 0603; JLCPCB Part Class: 基础库; Datasheet: https://atta.szlcsc.com/upload/public/pdf/source/20200306/C422600_1E6D84923E4A46A82E41ADD87F860B5C.pdf; Supplier: LCSC; Type: 厚膜电阻; Tolerance: ±1%; Power(Watts): 100mW; Overload Voltage (Max): 75V; Temperature Coefficient: ±100ppm/℃; Operating Temperature Range: -55℃~+155℃
R25 = FRC0603F1332TS: 电阻类型:厚膜电阻;阻值:13.3kΩ;精度:±1%;功率:100mW;最大工作电压:75V;温度系数:±100ppm/℃;; LCSC Part Name: 13.3kΩ ±1% 100mW 厚膜电阻; Supplier Part: C2933140; Manufacturer: FOJAN(富捷); Supplier Footprint: 0603; JLCPCB Part Class: 扩展库; Datasheet: https://atta.szlcsc.com/upload/public/pdf/source/20211221/925EC7D7225764EE0046F22065062C87.pdf; Supplier: LCSC; Type: 厚膜电阻; Tolerance: ±1%; Power(Watts): 100mW; Overload Voltage (Max): 75V; Temperature Coefficient: ±100ppm/℃; Operating Temperature Range: -55℃~+155℃
SW1 = XKB7070-Z: 自锁/无锁:自锁;安装方式:直插;触点电流:100mA;额定电压 (AC):250V;额定电压 (DC):30V;带灯:不带;作用力:160gf;机械寿命:10万次;; LCSC Part Name: 按键开关   7*7插件自锁 蓝白黑; Supplier Part: C318863; Manufacturer: XKB Connectivity(中国星坤); Supplier Footprint: 插件; Datasheet: https://atta.szlcsc.com/upload/public/pdf/source/20211015/75A682A27A424BDE8D93C2CFA14C38FE.pdf; Supplier: LCSC; Self Lock / No Lock: 自锁; Actuator Style: 矩形按钮; Mounting Style: 直插; Contact Current: 100mA; Voltage Rating (AC): 250V; Voltage Rating (DC): 30V; Insulation Resistance: 100MΩ; Actuator/Cap Color: 蓝色; With Lamp: 不带; Pin Style: PC引脚; Operating Force: 160gf; Operating Temperature: -15℃~+55℃; Mechanical Life: 10万次
U6 = TPS54302DDCR: 功能类型:降压型;输出类型:固定;工作电压:4.5V~28V;输出电压:5V;输出电流:3A;; LCSC Part Name: 4.5V至28V输入、3A输出、EMI友好的同步降压转换器; Supplier Part: C311983; Manufacturer: TI(德州仪器); Supplier Footprint: TSOT-23-6; JLCPCB Part Class: 扩展库; Datasheet: https://www.ti.com/cn/lit/gpn/tps54302; Supplier: LCSC; Function: 降压型; Output Type: 固定; Input Voltage: 4.5V~28V; Output Voltage: 5V; Output Current: 3A; Switching Frequency: 400kHz; Operating Temperature: -40℃~+125℃; Synchronous Rectification: 是; Number of Outputs: 1; Topology: 降压式; Quiescent Current (Iq): 45uA; Switch tube (built-in/external): 内置
U7 = BM06B-SRSS-TB(LF)(SN): 插针结构:1x6P;间距:1mm;安装方式:立贴;参考系列:SH;总PIN数:6P;排数:1;每排PIN数:6;行距:-;额定电流:1A;触头材质:铜合金;触头镀层:锡;工作温度范围:-25℃~+85℃;; LCSC Part Name: 1x6P 间距:1mm 立贴 系列:SH; Supplier Part: C160392; Manufacturer: JST; Supplier Footprint: SMD,P=1mm; JLCPCB Part Class: 扩展库; Datasheet: https://atta.szlcsc.com/upload/public/pdf/source/20181008/C268118_5C0FE2784716D1E5DD0A36233D1E1F34.pdf; Supplier: LCSC; Pins Structure: 1x6P; Pitch: 1mm; Mounting Style: 立贴; Reference Series: SH; Number of Pins: 6P; Number of Rows: 1; Number of PINs Per Row: 6; Current Rating (Max): 1A; Contact Material: 铜合金; Contact Plating: 锡; Operating Temperature Range: -25℃~+85℃; Rated Voltage (Max): 50V; Plastic Material: PA; Flame Retardant Rating: UL94V-0; Supplementary Features: 辅助焊脚; Colour: 白色; Z-Height of the Board: 4.25mm; X-Length of Bottom Edge on Board (Spacing Line): 8mm; Y-Width of Bottom Edge on Board: 3.6mm
A1 = ANT: 适用于PN532的RFID射频天线; Check: false
C8 C17 = 0603CG240J500NT: 容值:24pF;精度:±5%;额定电压:50V;材质(温度系数):C0G;; LCSC Part Name: 24pF ±5% 50V; Supplier Part: C1654; Manufacturer: FH(风华); Supplier Footprint: 0603; Datasheet: https://atta.szlcsc.com/upload/public/pdf/source/20200305/C486355_26A10D38EF8C2A5C37091D0039909270.pdf; Supplier: LCSC; Tolerance: ±5%; Voltage Rated: 50V; Temperature Coefficient: C0G
C9 C18 = CL10C010BB8NNNC: 容值:1pF;额定电压:50V;材质(温度系数):C0G;; LCSC Part Name: 1pF 50V; Supplier Part: C307493; Manufacturer: SAMSUNG(三星); Supplier Footprint: 0603; JLCPCB Part Class: 扩展库; Supplier: LCSC; Voltage Rated: 50V; Temperature Coefficient: C0G
C11 C14 = 0603CG4R7C500NT: 容值:4.7pF;额定电压:50V;材质(温度系数):C0G;; LCSC Part Name: 4.7pF 50V; Supplier Part: C1669; Manufacturer: FH(风华); Supplier Footprint: 0603; JLCPCB Part Class: 扩展库; Datasheet: https://atta.szlcsc.com/upload/public/pdf/source/20200305/C486355_26A10D38EF8C2A5C37091D0039909270.pdf; Supplier: LCSC; Voltage Rated: 50V; Temperature Coefficient: C0G
C12 C15 = C0603C121J5GACAUTO: 容值:120pF;精度:±5%;额定电压:50V;材质(温度系数):C0G;; LCSC Part Name: 120pF ±5% 50V; Supplier Part: C599667; Manufacturer: KEMET(基美); Supplier Footprint: 0603; Datasheet: https://atta.szlcsc.com/upload/public/pdf/source/20200618/C599667_5D8E1C0C504B354CF1A07A6514AE6546.pdf; Supplier: LCSC; Tolerance: ±5%; Voltage Rated: 50V; Temperature Coefficient: C0G
C13 C16 = CC0603KRX7R9BB221: 容值:220pF;精度:±10%;额定电压:50V;材质(温度系数):X7R;; LCSC Part Name: 220pF ±10% 50V; Supplier Part: C107081; Manufacturer: YAGEO(国巨); Supplier Footprint: 0603; JLCPCB Part Class: 扩展库; Datasheet: https://atta.szlcsc.com/upload/public/pdf/source/20180910/C282072_33301C7F631E79921B82A8DAC6BCC5B3.pdf; Supplier: LCSC; Tolerance: ±10%; Voltage Rated: 50V; Temperature Coefficient: X7R
C21 = CC0603KRX7R9BB102: 容值:1nF;精度:±10%;额定电压:50V;材质(温度系数):X7R;; LCSC Part Name: 1nF ±10% 50V; Supplier Part: C100040; Manufacturer: YAGEO(国巨); Supplier Footprint: 0603; JLCPCB Part Class: 扩展库; Datasheet: https://atta.szlcsc.com/upload/public/pdf/source/20180910/C282072_33301C7F631E79921B82A8DAC6BCC5B3.pdf; Supplier: LCSC; Tolerance: ±10%; Voltage Rated: 50V; Temperature Coefficient: X7R
C26 C27 = CL10C200JB8NNNC: 容值:20pF;精度:±5%;额定电压:50V;材质(温度系数):C0G;; LCSC Part Name: 20pF ±5% 50V; Supplier Part: C1648; Manufacturer: SAMSUNG(三星); Supplier Footprint: 0603; JLCPCB Part Class: 基础库; Datasheet: https://atta.szlcsc.com/upload/public/pdf/source/20160218/1457707763339.pdf; Supplier: LCSC; Tolerance: ±5%; Voltage Rated: 50V; Temperature Coefficient: C0G
L1 L2 = CMI160808VR56KT: 电感值:560nH;精度:±10%;额定电流:50mA;饱和电流(Isat):-;直流电阻(DCR):700mΩ;; LCSC Part Name: 560nH ±10%; Supplier Part: C139215; Manufacturer: FH(风华); Supplier Footprint: 0603; JLCPCB Part Class: 扩展库; Datasheet: https://atta.szlcsc.com/upload/public/pdf/source/20230223/55F203729CE6F04E1707F35DF12034EB.pdf; Supplier: LCSC; Tolerance: ±10%; Rated Current: 50mA; DC Resistance (DCR): 700mΩ
L3 L4 = VHF160808H2N2ST: 电感值:2.2nH;额定电流:400mA;饱和电流(Isat):-;直流电阻(DCR):200mΩ;; Supplier Part: C1028; Manufacturer: FH(风华); Supplier Footprint: 0603; JLCPCB Part Class: 扩展库; Datasheet: https://atta.szlcsc.com/upload/public/pdf/source/20230223/8EF545BE87E825DABED9AF3380ABCE94.pdf; Supplier: LCSC; Rated Current: 400mA; DC Resistance (DCR): 200mΩ
R13 R14 = 0603WAF620KT5E: 电阻类型:厚膜电阻;阻值:6.2Ω;精度:±1%;功率:100mW;最大工作电压:75V;温度系数:±200ppm/℃;; LCSC Part Name: 6.2Ω ±1% 100mW 厚膜电阻; Supplier Part: C23210; Manufacturer: UNI-ROYAL(厚声); Supplier Footprint: 0603; JLCPCB Part Class: 扩展库; Datasheet: https://atta.szlcsc.com/upload/public/pdf/source/20200306/C422600_1E6D84923E4A46A82E41ADD87F860B5C.pdf; Supplier: LCSC; Type: 厚膜电阻; Tolerance: ±1%; Power(Watts): 100mW; Overload Voltage (Max): 75V; Temperature Coefficient: ±200ppm/℃; Operating Temperature Range: -55℃~+155℃
R15 = 0603WAF2001T5E: 电阻类型:厚膜电阻;阻值:2kΩ;精度:±1%;功率:100mW;最大工作电压:75V;温度系数:±100ppm/℃;; LCSC Part Name: 2kΩ ±1% 100mW 厚膜电阻; Supplier Part: C22975; Manufacturer: UNI-ROYAL(厚声); Supplier Footprint: 0603; JLCPCB Part Class: 基础库; Datasheet: https://atta.szlcsc.com/upload/public/pdf/source/20200306/C422600_1E6D84923E4A46A82E41ADD87F860B5C.pdf; Supplier: LCSC; Type: 厚膜电阻; Tolerance: ±1%; Power(Watts): 100mW; Overload Voltage (Max): 75V; Temperature Coefficient: ±100ppm/℃; Operating Temperature Range: -55℃~+155℃
U5 = PN5321A3HN/C106,55: 协议:ISO 14443,ISO 15693,ISO 18092;接口类型:I2C,SPI;传输速率:424Kbps；212Kbps；106Kbps;; Supplier Part: C28925; Manufacturer: NXP(恩智浦); Supplier Footprint: QFN-40-EP(6x6); JLCPCB Part Class: 扩展库; Datasheet: https://www.nxp.com/docs/en/nxp/data-sheets/PN532_C1.pdf; Supplier: LCSC; agreement: ISO 14443,ISO 15693,ISO 18092; interface type: I2C,SPI; transmission rate: 424Kbps；212Kbps；106Kbps; mains input: 2.7V~5.5V
X1 = X32252712MOB4SI: 晶振类型:贴片晶振;频率:27.12MHz;常温频差:±10ppm;外接负载电容:12pF;频率稳定度(全温):±20ppm;; LCSC Part Name: 27.12MHz ±10ppm 12pF; Supplier Part: C113669; Manufacturer: YXC(扬兴晶振); Supplier Footprint: SMD3225-4P; JLCPCB Part Class: 扩展库; Datasheet: https://atta.szlcsc.com/upload/public/pdf/source/20240329/19D5F850207469550BEB00D7DFEDBC7A.pdf; Supplier: LCSC; Crystal Type: 贴片晶振; Normal temperature Frequency Tolerance: ±10ppm; External load capacitor: 12pF; Frequency Stability(Full temperature range): ±20ppm; Operating Temperature: -40℃~+85℃

## Nets
3V3: BUZZER1.1(+) C1.1 C4.2 C5.2 C7.1 C10.2 C22.2 C24.2 FPC1.6 H1.2 L3.1 L4.1 Q5.2(S) R4.1 R9.2 R10.2 R17.1 R19.2 R26.2 U1.2(VOUT(TAB)) U1.4(TAB) U3.2(3V3) U4.4(V3) U4.16(VCC) U5.39(DVDD) U5.40(VBAT) U7.1
+5V: C2.1 D1.2(K) D2.2(K) Q1.2(S) R2.2 R5.2 U1.3(VIN)
AVDD: C25.2 L4.2 U5.8(AVDD)
GND: A1.2(GND) BAT1.2 C1.2 C2.2 C3.2 C4.1 C5.1 C6.1 C7.2 C10.1 C11.1 C12.1 C13.1 C14.2 C15.2 C16.2 C19.2 C20.1 C22.1 C23.1 C24.1 C25.1 C26.2 C27.1 C28.1 C29.1 C31.1 C32.1 CN1.2 FPC1.1 FPC1.7 FPC1.8 H1.1 LOCK.1(K) POWER.1(K) Q2.2(E) R1.2 R3.2 R8.1 R18.1 R20.1 R22.1 R25.1 RESET.1 U1.1(ADJ(GND)) U3.1(GND) U3.15(GND) U3.38(GND) U3.39(GND) U4.1(GND) U5.1(DVSS) U5.3(TVSS1) U5.7(TVSS2) U5.11(AVSS) U5.18(TESTEN) U5.24(P30/UART_RX) U5.36(SIGIN) U5.41(EP) U6.1(GND) U7.6 U7.7 U7.8 USB1.1(GND) USB1.12(GND) USB1.13(SHELL) USB1.14(SHELL) X1.2(GND) X1.4(GND)
PVDD: C20.2 U5.23(PVDD)
VBUS: F1.2 USB1.2(VBUS) USB1.11(VBUS)
BATTERY: U3.7(IO35)
BUZZER: U2.3 U3.31(IO19)
CH340_RXD: U3.35(TXD0) U4.3(RXD)
CH340_TXD: U3.34(RXD0) U4.2(TXD)
D_N: U4.6(D-) USB1.5(DN2) USB1.7(DN1)
D_P: U4.5(D+) USB1.6(DP1) USB1.8(DP2)
DTR: Q4.2(E) R11.1 U4.13(DTR#)
EN: C3.1 Q3.3(C) R4.2 RESET.2 U3.3(EN)
FT6336U_INT: FPC1.3 U3.10(IO25)
FT6336U_RST: FPC1.2 U3.33(IO21)
I0: R17.2 U5.16(I0)
I1: R18.2 U5.17(I1)
I2C_SCL: FPC1.5 H1.3 R9.1 U3.9(IO33) U5.27(NSS/P50_SCL/HSU_RX)
I2C_SDA: FPC1.4 H1.4 R10.1 U3.8(IO32) U5.28(MOSI/SDA/HSU_TX)
IO0: Q4.3(C) U3.25(IO0)
LOCK_5V: CN1.1 Q1.3(D) R6.2
LOCK_CTL: R7.2 U3.36(IO22)
OSCIN: C26.1 U5.14(OSCIN) X1.1(OSC1)
OSCOUT: C27.2 U5.15(OSCOUT) X1.3(OSC2)
PN532_INT: U3.12(IO27) U5.25(P70_IRQ)
PN532_RST: U3.11(IO26) U5.26(RSTOUT_N)
RSTPD_N: R19.1 R20.2 U5.38(RSTPD_N)
RTS: Q3.2(E) R12.1 U4.14(RTS#)
RX: C21.2 R16.1 U5.10(RX)
TVDD: C23.2 L3.2 U5.5(TVDD)
TX1: L1.2 U5.4(TX1)
TX2: L2.2 U5.6(TX2)
VMID: C19.1 R16.2 U5.9(VMID)
ZW101_CTL: Q5.1(G) R26.1 U3.29(IO5)
ZW101_INT: U3.30(IO18) U7.2
ZW101_RX: U3.27(IO16) U7.5
ZW101_TX: U3.28(IO17) U7.4
ZW101_VCC: Q5.3(D) U7.3
$1N2642: Q3.1(B) R11.2
$1N2757: Q4.1(B) R12.2
$1N5857: LOCK.2(A) R6.1
$1N6044: D1.1(A) F1.1
$1N8498: POWER.2(A) R2.1
$1N17322: R1.1 USB1.10(CC2)
$1N17376: R3.1 USB1.4(CC1)
$1N17503: BUZZER1.2(-) U2.2
$1N17870: Q2.1(B) R7.1 R8.2
$2N11916: C8.1 C9.1 C13.2 L1.1
$2N11917: C16.1 C17.2 C18.2 L2.1 R15.2
$2N11919: C21.1 R15.1
$2N11925: A1.1(TX1) R13.1
$2N11926: C8.2 C9.2 C11.2 C12.2 R13.2
$2N11927: A1.3(TX2) R14.1
$2N11928: C14.1 C15.1 C17.1 C18.1 R14.2
$2N29530: C6.2 U5.37(SVDD)
$3N3212: C28.2 C29.2 F2.2 R21.2 U6.3(VIN)
$3N3216: BAT1.1 SW1.1
$3N3418: F2.1 SW1.2
$3N11108: R21.1 R22.2 U6.5(EN)
$3N11159: C30.2 L5.1 U6.2(SW)
$3N11163: C30.1 U6.6(BOOT)
$3N11747: C33.2 R23.1 R24.2
$3N11772: C33.1 R24.1 R25.2 U6.4(FB)
$3N15028: BAT1.3 BAT1.4
$3N15058: C31.2 C32.2 D2.1(A) L5.2 R23.2
Net-(Q1-1): Q1.1(G) R5.1

Not connected (* = marked no-connect by the designer): Q2 3(C); SCREW1 1*; SCREW2 1*; SCREW3 1*; SW1 3* 4* 5* 6*; U2 1*; U3 4(SENSOR_VP)* 5(SENSOR_VN)* 6(IO34)* 13(IO14)* 14(IO12)* 16(IO13)* 17(NC)* 18(NC)* 19(NC)* 20(NC)* 21(NC)* 22(NC)* 23(IO15)* 24(IO2)* 26(IO4)* 32(NC)* 37(IO23)*; U4 7(NC.)* 8(OUT#)* 9(CTS#)* 10(DSR#)* 11(RI#)* 12(DCD#)* 15(R232)*; U5 2(LOADMOD)* 12(AUX1)* 13(AUX2)* 19(P35)* 20(N.C.)* 21(N.C.)* 22(N.C.)* 29(MISO/P71)* 30(SCK/P72)* 31(P31/UART_TX)* 32(P32_INT0)* 33(P33_INT1)* 34(P34/SIC_CLK)* 35(SIGOUT)*; USB1 3(SBU2)* 9(SBU1)*

## Notes on the sheets
sheet 1
- 蜂鸣器
- 电流防倒灌
- LDO
- TYPEC口
- S
- D
- G
- 1 导通
  0 截止
- 复位按键
- 电磁锁
- MCU
- USB转串口
sheet 3
- 7.4降压5V
- FT6336U
- S
- D
- G
- 低电平导通
  高电平截止
- ZW101
- OLED12864
